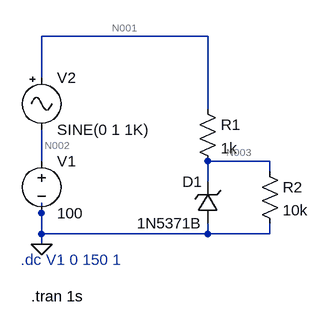
[diagram p0: schematic schemat.asc]
schemat.asc, the LTspice schematic file:
Version 4
SHEET 1 880 680
WIRE 208 -64 -48 -64
WIRE -48 0 -48 -64
WIRE 208 48 208 -64
WIRE -48 128 -48 80
WIRE 304 128 208 128
WIRE 304 144 304 128
WIRE 208 160 208 128
WIRE -48 208 -48 192
WIRE -48 240 -48 208
WIRE 208 240 208 224
WIRE 208 240 -48 240
WIRE 304 240 304 224
WIRE 304 240 208 240
WIRE -48 256 -48 240
FLAG -48 256 0
SYMBOL voltage -48 112 R0
WINDOW 123 0 0 Left 0
WINDOW 39 0 0 Left 0
SYMATTR InstName V1
SYMATTR Value 100
SYMBOL res 192 32 R0
SYMATTR InstName R1
SYMATTR Value 1k
SYMBOL zener 224 224 R180
WINDOW 0 24 64 Left 2
WINDOW 3 24 0 Left 2
SYMATTR InstName D1
SYMATTR Value 1N5371B
SYMATTR Description Diode
SYMATTR Type diode
SYMBOL Misc\\signal -48 -16 R0
WINDOW 123 0 0 Left 0
WINDOW 39 0 0 Left 0
SYMATTR InstName V2
SYMBOL res 288 128 R0
SYMATTR InstName R2
SYMATTR Value 10k
TEXT -80 280 Left 2 ;.dc V1 0 150 1
TEXT -64 336 Left 2 !.tran 1s

The netlist it stands for:
* schemat.asc
V1 N002 0 100
R1 N001 N003 1k
D1 0 N003 1N5371B
V2 N001 N002 SINE(0 1 1K)
R2 N003 0 10k
.model D D
.lib standard.dio
* .dc V1 0 150 1
.tran 1s
.backanno
.end

* Results of the author's LTspice run, read from the files saved beside the schematic
* Operating Point, zero values left out:
*   V(n002) = 100 V
*   V(n001) = 100 V
*   V(n003) = 60.4 V
*   I(D1) = -33.55 mA
*   I(R1) = 39.6 mA
*   I(R2) = 6.04 mA
*   I(V1) = -39.6 mA
*   I(V2) = -39.6 mA
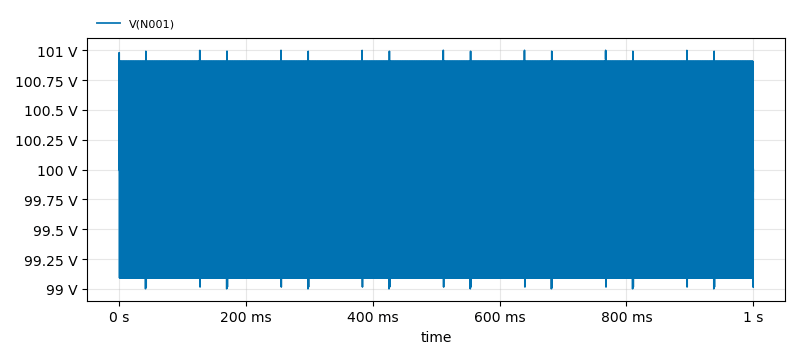
[diagram p1: Transient Analysis of schemat.asc, plotted from the saved traces]
* Transient Analysis, 1 run:
*   V(N001): min 99 V, max 101 V, average 100 V, rms 100 V, last 100 V